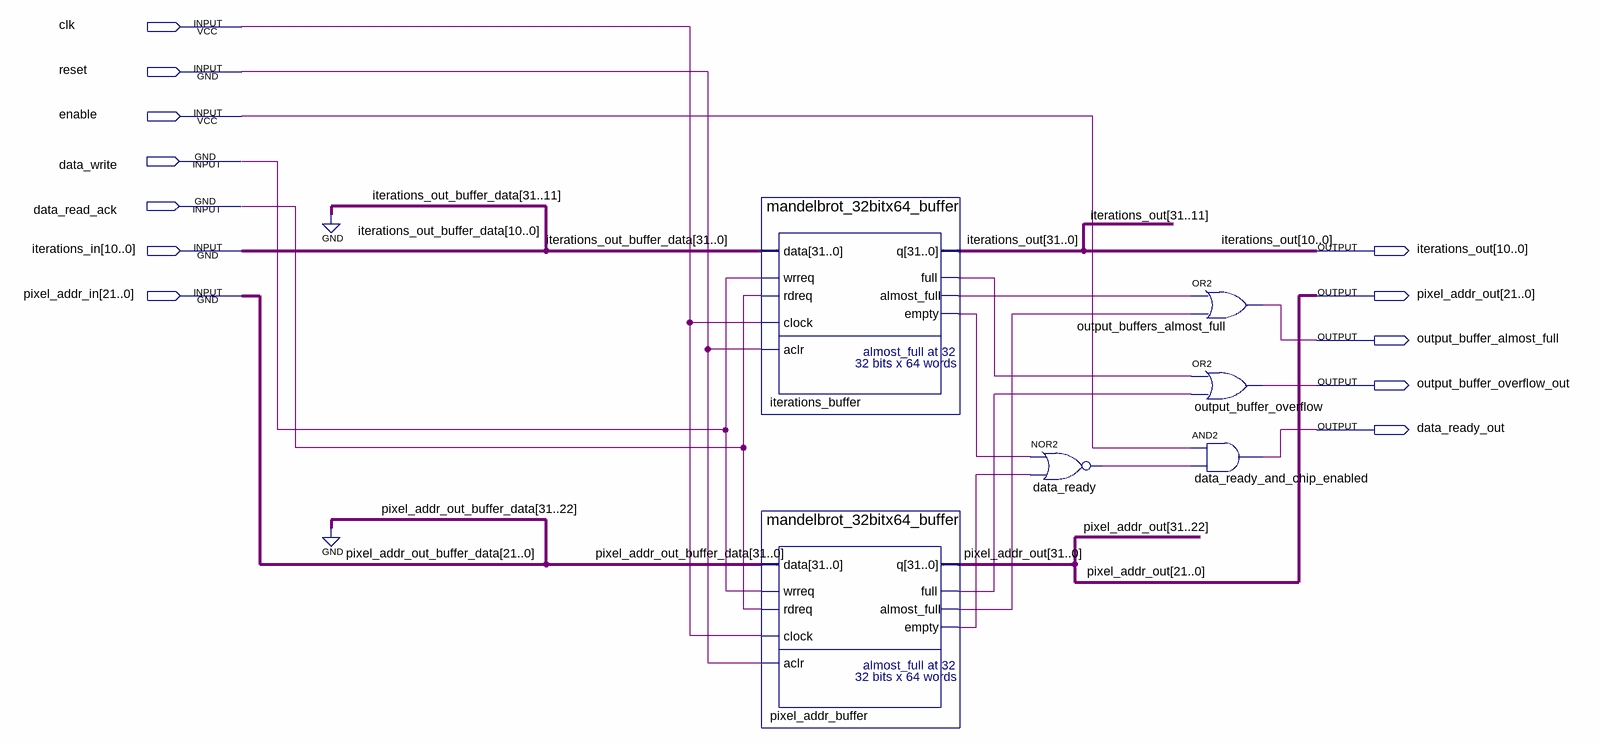
[diagram p0: schematic sheet]
// Quartus schematic mandelbrot_pipeline_output_buffer.bdf as structural Verilog: 6 symbols, 12 pins
module mandelbrot_pipeline_output_buffer (
  input  clk,
  input  reset,
  input  enable,
  input  data_write,
  input  data_read_ack,
  input  [10:0] iterations_in,
  input  [21:0] pixel_addr_in,
  output [31:0] iterations_out,
  output [31:0] pixel_addr_out,
  output output_buffer_almost_full,
  output output_buffer_overflow_out,
  output data_ready_out
);

  wire data_ready_out_2, iterations_buffer_almost_full, iterations_buffer_empty, iterations_buffer_full,
       pixel_addr_buffer_almost_full, pixel_addr_buffer_empty, pixel_addr_buffer_full;

  mandelbrot_32bitx64_buffer iterations_buffer (
    .data({{21{1'b0}}, iterations_in}), .wrreq(data_write), .rdreq(data_read_ack), .clock(clk), .aclr(reset),
    .q(iterations_out), .full(iterations_buffer_full), .almost_full(iterations_buffer_almost_full),
    .empty(iterations_buffer_empty));
  mandelbrot_32bitx64_buffer pixel_addr_buffer (
    .data({{10{1'b0}}, pixel_addr_in}), .wrreq(data_write), .rdreq(data_read_ack), .clock(clk), .aclr(reset),
    .q(pixel_addr_out), .full(pixel_addr_buffer_full), .almost_full(pixel_addr_buffer_almost_full),
    .empty(pixel_addr_buffer_empty));
  nor data_ready (data_ready_out_2, iterations_buffer_empty, pixel_addr_buffer_empty);
  or output_buffers_almost_full (output_buffer_almost_full, iterations_buffer_almost_full, pixel_addr_buffer_almost_full);
  or output_buffer_overflow (output_buffer_overflow_out, iterations_buffer_full, pixel_addr_buffer_full);
  and data_ready_and_chip_enabled (data_ready_out, enable, data_ready_out_2);

  // Other names for the same wires on the sheet: iterations_out_buffer_data[10:0] = iterations_in;
  //   pixel_addr_out_buffer_data[21:0] = pixel_addr_in
endmodule
